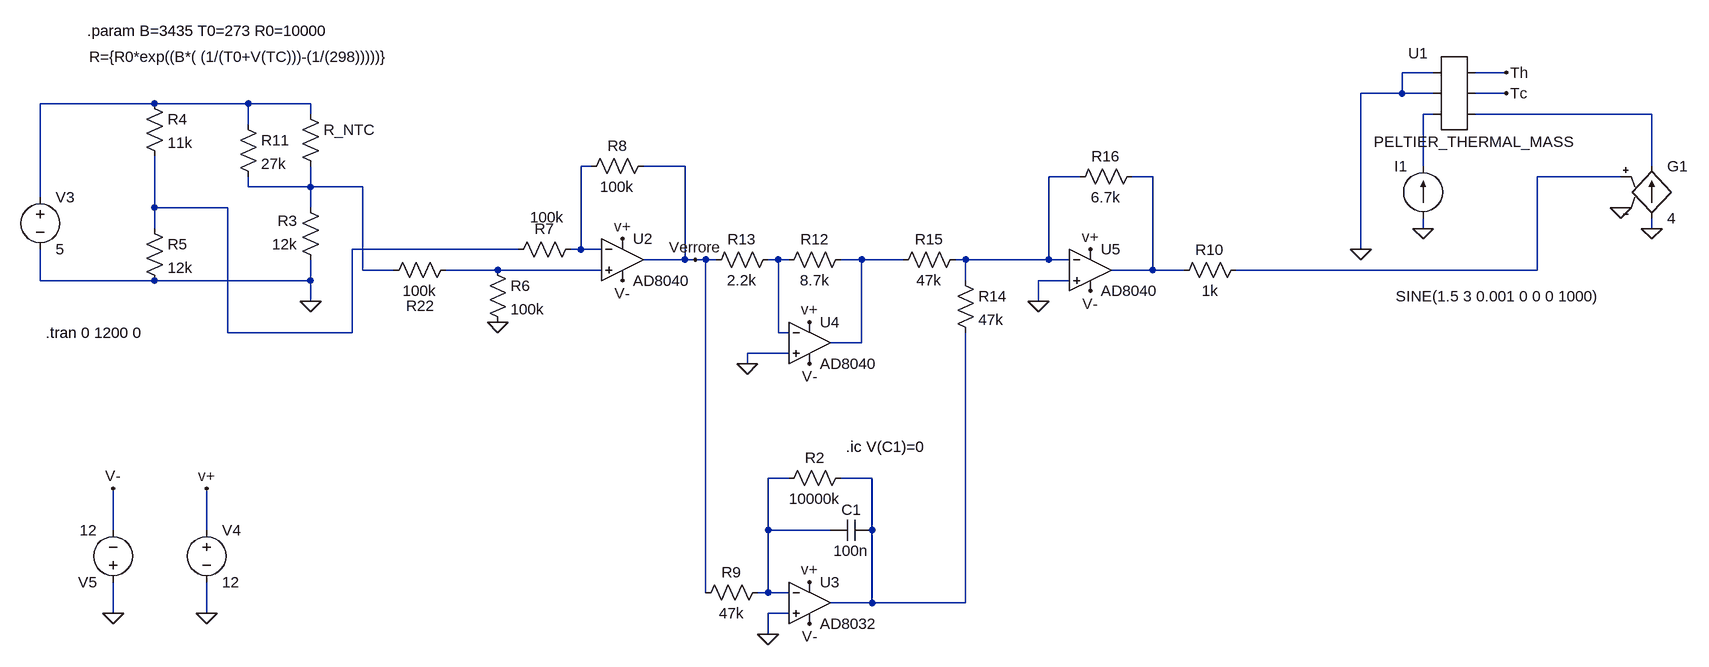
[diagram p0: schematic Peltier.asc]
Peltier.asc, the LTspice schematic file:
Version 4
SHEET 1 1980 840
WIRE 960 -208 912 -208
WIRE 1072 -208 1024 -208
WIRE 912 -176 912 -208
WIRE 912 -176 848 -176
WIRE 960 -176 912 -176
WIRE 1072 -176 1024 -176
WIRE -1008 -160 -1184 -160
WIRE -864 -160 -1008 -160
WIRE -768 -160 -864 -160
WIRE -768 -144 -768 -160
WIRE 960 -144 944 -144
WIRE 1296 -144 1024 -144
WIRE -864 -128 -864 -160
WIRE -336 -64 -352 -64
WIRE -192 -64 -256 -64
WIRE 944 -64 944 -144
WIRE 1296 -64 1296 -144
WIRE 416 -48 368 -48
WIRE 528 -48 496 -48
WIRE 1248 -48 1120 -48
WIRE -864 -32 -864 -48
WIRE -768 -32 -768 -64
WIRE -768 -32 -864 -32
WIRE -688 -32 -768 -32
WIRE -1184 -16 -1184 -160
WIRE -1008 0 -1008 -80
WIRE -896 0 -1008 0
WIRE -768 0 -768 -32
WIRE -1008 32 -1008 0
WIRE 944 32 944 16
WIRE 1296 32 1296 16
WIRE -448 64 -704 64
WIRE -352 64 -352 -64
WIRE -352 64 -368 64
WIRE -320 64 -352 64
WIRE 848 64 848 -176
WIRE -192 80 -192 -64
WIRE -192 80 -256 80
WIRE -176 80 -192 80
WIRE -160 80 -176 80
WIRE -144 80 -160 80
WIRE -48 80 -64 80
WIRE -32 80 -48 80
WIRE 80 80 48 80
WIRE 144 80 80 80
WIRE 240 80 224 80
WIRE 368 80 368 -48
WIRE 368 80 240 80
WIRE 400 80 368 80
WIRE -688 96 -688 -32
WIRE -640 96 -688 96
WIRE -480 96 -560 96
WIRE -320 96 -480 96
WIRE 528 96 528 -48
WIRE 528 96 464 96
WIRE 576 96 528 96
WIRE 1120 96 1120 -48
WIRE 1120 96 656 96
WIRE -1184 112 -1184 64
WIRE -1008 112 -1184 112
WIRE -768 112 -768 80
WIRE -768 112 -1008 112
WIRE 240 112 240 80
WIRE 400 112 352 112
WIRE -768 144 -768 112
WIRE 352 144 352 112
WIRE -896 192 -896 0
WIRE -704 192 -704 64
WIRE -704 192 -896 192
WIRE -48 192 -48 80
WIRE -32 192 -48 192
WIRE 80 208 80 80
WIRE 80 208 32 208
WIRE -32 224 -96 224
WIRE -96 240 -96 224
WIRE -32 416 -64 416
WIRE 96 416 48 416
WIRE -1072 496 -1072 432
WIRE -928 496 -928 432
WIRE -64 496 -64 416
WIRE 32 496 -64 496
WIRE 96 496 96 416
WIRE -160 592 -160 80
WIRE -64 592 -64 496
WIRE -64 592 -80 592
WIRE -32 592 -64 592
WIRE 96 608 96 496
WIRE 96 608 32 608
WIRE 240 608 240 192
WIRE 240 608 96 608
WIRE -1072 624 -1072 576
WIRE -928 624 -928 576
WIRE -32 624 -64 624
WIRE -64 656 -64 624
FLAG -768 144 0
FLAG -928 624 0
FLAG -928 432 v+
FLAG -1072 624 0
FLAG -1072 432 V-
FLAG -288 112 V-
FLAG -288 48 v+
FLAG 1072 -176 Tc
FLAG -480 176 0
FLAG 1296 32 0
FLAG 848 64 0
FLAG 1072 -208 Th
FLAG 1248 0 0
FLAG 0 640 V-
FLAG 0 576 v+
FLAG 944 32 0
FLAG 0 240 V-
FLAG 0 176 v+
FLAG -64 656 0
FLAG -96 240 0
FLAG 432 128 V-
FLAG 432 64 v+
FLAG 352 144 0
FLAG -176 80 Verrore
SYMBOL res -784 -160 R0
WINDOW 3 -325 -72 Left 2
SYMATTR Value R={R0*exp((B*( (1/(T0+V(TC)))-(1/(298)))))}
SYMATTR InstName R_NTC
SYMBOL voltage -1184 -32 R0
WINDOW 123 0 0 Left 0
WINDOW 39 0 0 Left 0
SYMATTR InstName V3
SYMATTR Value 5
SYMBOL res -752 96 R180
WINDOW 0 36 76 Left 2
WINDOW 3 36 40 Left 2
SYMATTR InstName R3
SYMATTR Value 12k
SYMBOL voltage -928 480 R0
WINDOW 123 0 0 Left 0
WINDOW 39 0 0 Left 0
SYMATTR InstName V4
SYMATTR Value 12
SYMBOL voltage -1072 592 R180
WINDOW 123 0 0 Left 0
WINDOW 39 0 0 Left 0
SYMATTR InstName V5
SYMATTR Value 12
SYMBOL res -656 112 R270
WINDOW 0 -54 57 VTop 2
WINDOW 3 0 56 VBottom 2
SYMATTR InstName R22
SYMATTR Value 100k
SYMBOL Opamps\\AD8040 -288 16 R0
SYMATTR InstName U2
SYMBOL res -880 -144 R0
SYMATTR InstName R11
SYMATTR Value 27k
SYMBOL AutoGenerated\\PELTIER_THERMAL_MASS 992 -176 M0
WINDOW 3 -31 59 Top 2
SYMATTR InstName U1
SYMBOL res -1024 -176 R0
SYMATTR InstName R4
SYMATTR Value 11k
SYMBOL res -1024 16 R0
SYMATTR InstName R5
SYMATTR Value 12k
SYMBOL res -496 80 R0
SYMATTR InstName R6
SYMATTR Value 100k
SYMBOL res -352 48 R90
WINDOW 0 0 56 VBottom 2
WINDOW 3 -49 52 VTop 2
SYMATTR InstName R7
SYMATTR Value 100k
SYMBOL res -240 -80 R90
WINDOW 0 0 56 VBottom 2
WINDOW 3 32 56 VTop 2
SYMATTR InstName R8
SYMATTR Value 100k
SYMBOL g 1296 -80 R0
SYMATTR InstName G1
SYMATTR Value 4
SYMBOL res -64 576 R90
WINDOW 0 0 56 VBottom 2
WINDOW 3 32 56 VTop 2
SYMATTR InstName R9
SYMATTR Value 47k
SYMBOL cap 96 480 R90
WINDOW 0 0 32 VBottom 2
WINDOW 3 32 32 VTop 2
SYMATTR InstName C1
SYMATTR Value 100n
SYMBOL res 672 80 R90
WINDOW 0 0 56 VBottom 2
WINDOW 3 32 56 VTop 2
SYMATTR InstName R10
SYMATTR Value 1k
SYMBOL current 944 16 R180
WINDOW 0 24 80 Left 2
WINDOW 3 -273 -120 Left 2
WINDOW 123 0 0 Left 0
WINDOW 39 0 0 Left 0
SYMATTR InstName I1
SYMATTR Value SINE(1.5 3 0.001 0 0 0 1000)
SYMBOL Opamps\\AD8040 0 144 R0
SYMATTR InstName U4
SYMBOL res 64 64 R90
WINDOW 0 0 56 VBottom 2
WINDOW 3 32 56 VTop 2
SYMATTR InstName R12
SYMATTR Value 8.7k
SYMBOL res -48 64 R90
WINDOW 0 0 56 VBottom 2
WINDOW 3 32 56 VTop 2
SYMATTR InstName R13
SYMATTR Value 2.2k
SYMBOL Opamps\\AD8040 432 32 R0
SYMATTR InstName U5
SYMBOL res 224 96 R0
SYMATTR InstName R14
SYMATTR Value 47k
SYMBOL res 240 64 R90
WINDOW 0 0 56 VBottom 2
WINDOW 3 32 56 VTop 2
SYMATTR InstName R15
SYMATTR Value 47k
SYMBOL res 512 -64 R90
WINDOW 0 0 56 VBottom 2
WINDOW 3 32 56 VTop 2
SYMATTR InstName R16
SYMATTR Value 6.7k
SYMBOL Opamps\\AD8032 0 544 R0
SYMATTR InstName U3
SYMBOL res 64 400 R90
WINDOW 0 0 56 VBottom 2
WINDOW 3 32 56 VTop 2
SYMATTR InstName R2
SYMATTR Value 10000k
TEXT -1112 -272 Left 2 !.param B=3435 T0=273 R0=10000
TEXT -1176 192 Left 2 !.tran 0 1200 0
TEXT 56 368 Left 2 !.ic V(C1)=0

The netlist it stands for:
* Peltier.asc
R_NTC N001 N008 R={R0*exp((B*( (1/(T0+V(TC)))-(1/(298)))))}
V3 N001 0 5
R3 0 N008 12k
V4 v+ 0 12
V5 0 V- 12
R22 N008 N012 100k
XU2 N012 N004 v+ V- Verrore AD8040  ; pins In+ In- V+ V- OUT
R11 N001 N008 27k
* U1: PELTIER_THERMAL_MASS (symbol AutoGenerated\PELTIER_THERMAL_MASS not available, pins judged from their places): pin1=Th pin2=Tc pin3=N003 pin4=0 pin5=0 pin6=N002
R4 N001 N009 11k
R5 N009 0 12k
R6 N012 0 100k
R7 N004 N009 100k
R8 Verrore N004 100k
G1 0 N003 N007 0 4
R9 N013 Verrore 47k
C1 N014 N013 100n
R10 N007 N006 1k
I1 0 N002 SINE(1.5 3 0.001 0 0 0 1000)
XU4 0 N010 v+ V- N011 AD8040  ; pins In+ In- V+ V- OUT
R12 N011 N010 8.7k
R13 N010 Verrore 2.2k
XU5 0 N005 v+ V- N006 AD8040  ; pins In+ In- V+ V- OUT
R14 N005 N014 47k
R15 N005 N011 47k
R16 N006 N005 6.7k
XU3 0 N013 v+ V- N014 AD8032  ; pins In+ In- V+ V- OUT
R2 N014 N013 10000k
.param B=3435 T0=273 R0=10000
.tran 0 1200 0
.ic V(C1)=0
.backanno
.end